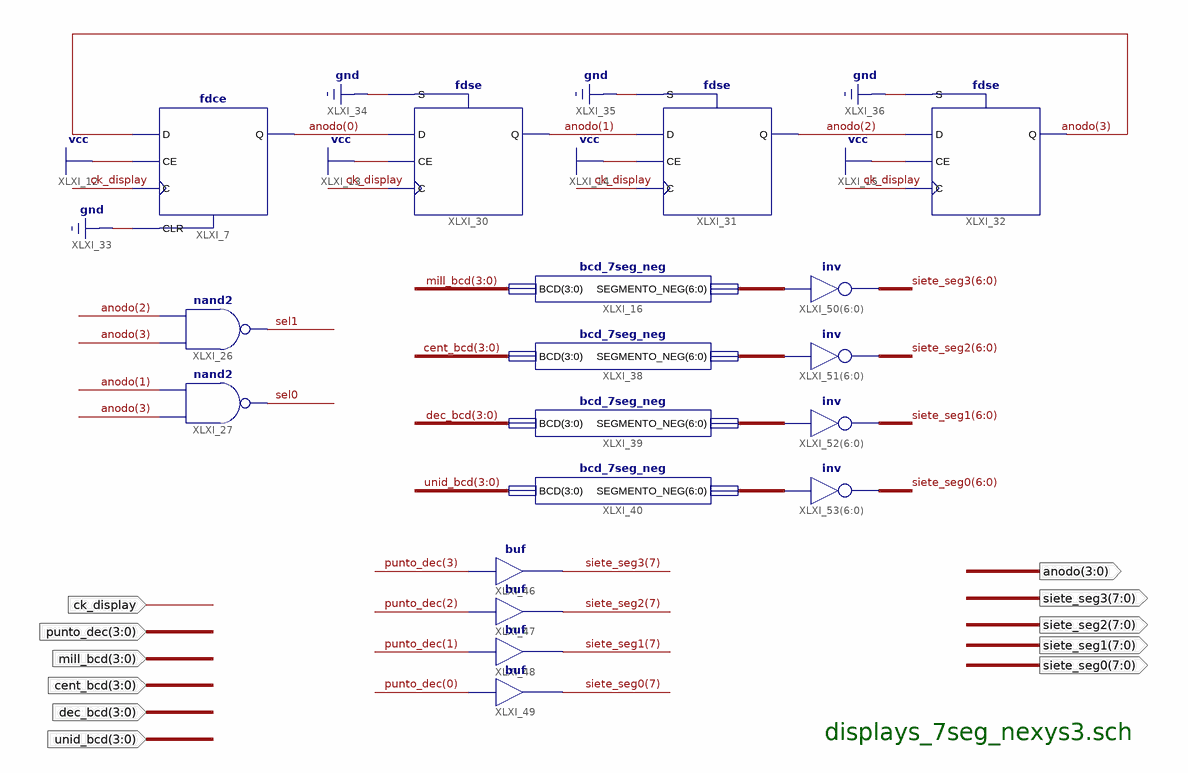
[diagram p0: schematic sheet 1]
// Xilinx ISE schematic displays_7seg_nexys3_RemLab.sch (spartan6) as structural Verilog: 18 symbols, 11 ports
module displays_7seg_nexys3_RemLab (
  input  [3:0] mill_bcd,
  input  [3:0] cent_bcd,
  input  [3:0] dec_bcd,
  input  [3:0] unid_bcd,
  input  ck_display,
  input  [3:0] punto_dec,
  output [3:0] anodo,
  output [7:0] siete_seg3,
  output [7:0] siete_seg2,
  output [7:0] siete_seg1,
  output [7:0] siete_seg0
);

  wire sel0, sel1;
  wire [6:0] XLXN_91, XLXN_92, XLXN_93, XLXN_94;

  fdce XLXI_7 (.C(ck_display), .CE(1'b1), .CLR(1'b0), .D(anodo[3]), .Q(anodo[0]));
  nand XLXI_26 (sel1, anodo[3], anodo[2]);
  nand XLXI_27 (sel0, anodo[3], anodo[1]);
  fdse XLXI_30 (.C(ck_display), .CE(1'b1), .D(anodo[0]), .S(1'b0), .Q(anodo[1]));
  fdse XLXI_31 (.C(ck_display), .CE(1'b1), .D(anodo[1]), .S(1'b0), .Q(anodo[2]));
  fdse XLXI_32 (.C(ck_display), .CE(1'b1), .D(anodo[2]), .S(1'b0), .Q(anodo[3]));
  buf XLXI_46 (siete_seg3[7], punto_dec[3]);
  buf XLXI_47 (siete_seg2[7], punto_dec[2]);
  buf XLXI_48 (siete_seg1[7], punto_dec[1]);
  buf XLXI_49 (siete_seg0[7], punto_dec[0]);
  bcd_7seg_neg XLXI_38 (.BCD(cent_bcd), .SEGMENTO_NEG(XLXN_92));
  bcd_7seg_neg XLXI_39 (.BCD(dec_bcd), .SEGMENTO_NEG(XLXN_93));
  bcd_7seg_neg XLXI_40 (.BCD(unid_bcd), .SEGMENTO_NEG(XLXN_94));
  bcd_7seg_neg XLXI_16 (.BCD(mill_bcd), .SEGMENTO_NEG(XLXN_91));
  assign siete_seg3[6:0] = ~XLXN_91;  // inv XLXI_50[6..0], 7 bits wide
  assign siete_seg2[6:0] = ~XLXN_92;  // inv XLXI_51[6..0], 7 bits wide
  assign siete_seg1[6:0] = ~XLXN_93;  // inv XLXI_52[6..0], 7 bits wide
  assign siete_seg0[6:0] = ~XLXN_94;  // inv XLXI_53[6..0], 7 bits wide

  // Notes on the sheet:
  //   displays_7seg_nexys3.sch
endmodule
